# Altium schematic sheet Supply.SchDoc: Title (part 3 of 3)
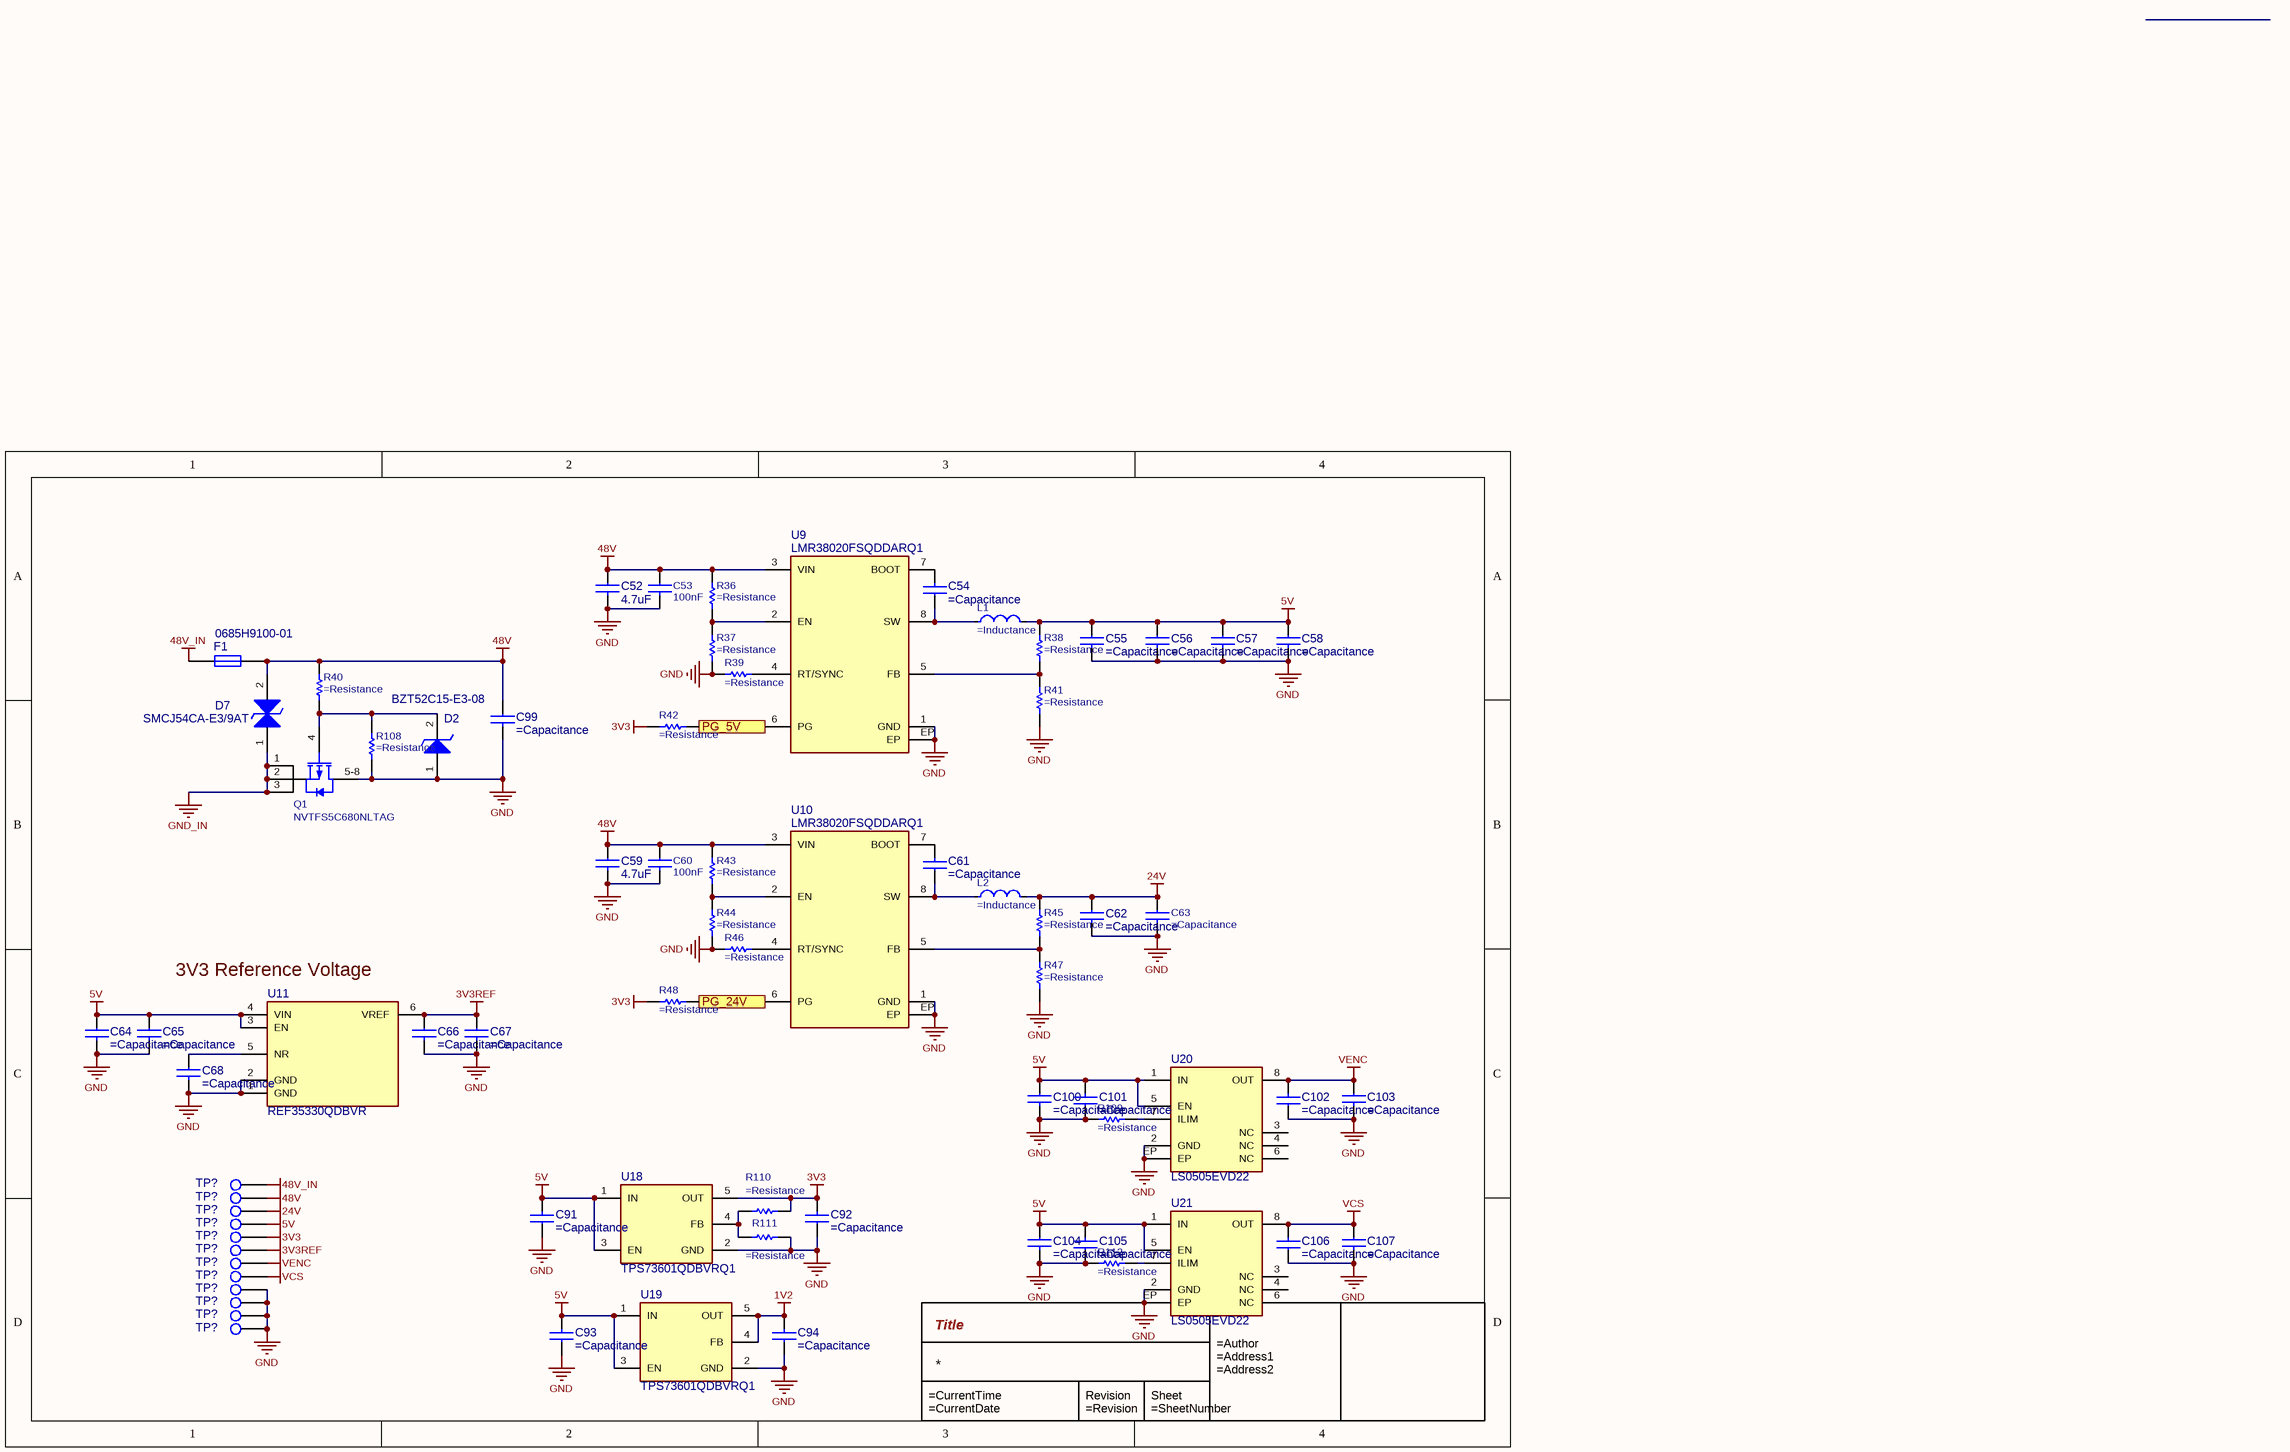
[diagram p2: Supply.SchDoc]

## Library data of the parts (continued)
R38 R45 = RES0402-100k-1%: Res Thick Film 0402 100K Ohm 1% 0.063W(1/16W) ±100ppm/C Molded SMD Automotive Paper T/R; Manufacturer: Vishay; Manufacturer Part Number: CRCW0402100KFKEE; Resistance: 100kΩ; Max Power Dissipation: 63mW; Value: 100kΩ; Temperature Coefficient: 100ppm/°C; Voltage Rating: 50V; Supplier 1: DigiKey; Supplier Part Number 1: 541-CRCW0402100KFKEECT-ND; Supplier: DigiKey; Supplier Part Number: 541-CRCW0402100KFKEECT-ND; RoHS: Compliant; Category: Chip SMD Resistors; Stock: 14497; Pricing: 1=0,1, 10=0,03, 25=0,0224, 50=0,018, 100=0,0148, 250=0,01156, 500=0,00974, 1000=0,00832, 5000=0,00606 (USD); Case/Package: 0402; China RoHS: Non-Compliant; Composition: Thick Film; Contact Plating: Tin; Depth: 500µm; Features: Automotive AEC-Q200; Height: 350µm; Lead Free: Lead Free; Length: 990.6µm; Lifecycle Status: Production; Max Operating Temperature: 155°C; Military Standard: Not; Min Operating Temperature: -55°C; Mounting Technology: Surface Mount; Number of Terminals: 2; Number of Terminations: 2; Packaging: Tape & Reel; Power Dissipation: 63mW; Power Rating: 63mW; Radiation Hardening: No; REACH SVHC: Yes; Schedule B: 8533210045, 8533210045|8533210045|8533210045|8533210045|8533210045|8533210045|8533210045|8533210045|8533210045|8533210045|8533210045|8533210045|8533210045|8533210045|8533210045|8533210045|8533210045|8533210045|8533210045|8533210045|8533210045|8533210045|8533210045|85; Tolerance: 1%; Voltage Rating (DC): 50V; Width: 500µm; Working Voltage: 50V; ComponentLink1URL: https://datasheet.octopart.com:443/CRCW0402100KFKEE-Vishay-datasheet-175423584.pdf?src-supplier=IHS; ComponentLink1Description: https://datasheet.octopart.com:443/CRCW0402100KFKEE-Vishay-datasheet-175423584.pdf?src-supplier=IHS; ComponentLink2URL: https://datasheet.octopart.com:443/CRCW0402100KFKEE-Vishay-datasheet-190005712.pdf?src-supplier=TME; ComponentLink2Description: https://datasheet.octopart.com:443/CRCW0402100KFKEE-Vishay-datasheet-190005712.pdf?src-supplier=TME; ComponentLink3URL: https://datasheet.octopart.com:443/CRCW0402100KFKEE-Vishay-datasheet-62316122.pdf?src-supplier=Future+Electronics; ComponentLink3Description: https://datasheet.octopart.com:443/CRCW0402100KFKEE-Vishay-datasheet-62316122.pdf?src-supplier=Future+Electronics; ComponentLink4URL: https://datasheet.octopart.com/D-CRCW-e3-Standard-Thick-Film-Chip-Resistors-Vishay-datasheet-family-64.pdf; ComponentLink4Description: https://datasheet.octopart.com/D-CRCW-e3-Standard-Thick-Film-Chip-Resistors-Vishay-datasheet-family-64.pdf; ComponentLink5URL: http://sigma.octopart.com:80/rohs_certificate/D-CRCW-e3-Standard-Thick-Film-Chip-Resistors-Vishay-family-102.pdf?src-supplier=Compliance+Statements; ComponentLink5Description: http://sigma.octopart.com:80/rohs_certificate/D-CRCW-e3-Standard-Thick-Film-Chip-Resistors-Vishay-family-102.pdf?src-supplier=Compliance+Statements
R39 = RES0402-64.9k-1%: Res Thick Film 0402 64.9K Ohm 1% 0.1W(1/10W) ±100ppm/C Pad SMD T/R Automotive AEC-Q200; Manufacturer: KOA Speer; Manufacturer Part Number: RK73H1ETTP6492F; Resistance: 64.9kΩ; Power Dissipation: 100mW; Power Rating: 63mW; Value: 64.9kΩ; Temperature Coefficient: 100ppm/°C; Voltage Rating: 50V; Working Voltage: 75V; Supplier 1: DigiKey; Supplier Part Number 1: 2019-RK73H1ETTP6492FCT-ND; Supplier: DigiKey; Supplier Part Number: 2019-RK73H1ETTP6492FCT-ND; RoHS: Compliant; Category: Chip SMD Resistors; Stock: 44078; Pricing: 1=0,1, 10=0,027, 25=0,0196, 50=0,0158, 100=0,0129, 250=0,01004, 500=0,0084, 1000=0,00713, 5000=0,00544 (USD); Case/Package: 0402; Case Code (Imperial): 0402; Case Code (Metric): 1005; China RoHS: Non-Compliant; Composition: Thick Film; Depth: 500µm; Height: 350µm; Lead Free: Lead Free; Length: 1mm; Lifecycle Status: Production; Max Operating Temperature: 155°C; Military Standard: Not; Min Operating Temperature: -55°C; Mounting Technology: Surface Mount; Number of Terminals: 2; REACH SVHC: Yes; Schedule B: 8533210045, 8533210045|8533210045|8533210045|8533210045|8533210045; Termination: SMD/SMT; Tolerance: 1%; Voltage Rating (DC): 50V; Width: 500µm; ComponentLink1URL: https://datasheet.octopart.com:443/RK73H1ETTP6492F-KOA-Speer-datasheet-181956035.pdf?src-supplier=IHS; ComponentLink1Description: https://datasheet.octopart.com:443/RK73H1ETTP6492F-KOA-Speer-datasheet-181956035.pdf?src-supplier=IHS; ComponentLink2URL: https://datasheet.octopart.com:443/RK73H1ETTP6492F-KOA-Speer-datasheet-11590619.pdf?src-supplier=Upverter; ComponentLink2Description: https://datasheet.octopart.com:443/RK73H1ETTP6492F-KOA-Speer-datasheet-11590619.pdf?src-supplier=Upverter; ComponentLink3URL: https://datasheet.octopart.com:443/RK73H1ETTP6492F-KOA-Speer-datasheet-149653815.pdf?src-supplier=element14+APAC; ComponentLink3Description: https://datasheet.octopart.com:443/RK73H1ETTP6492F-KOA-Speer-datasheet-149653815.pdf?src-supplier=element14+APAC; ComponentLink4URL: https://datasheet.octopart.com/RK73H-%7C-Flat-Chip-Resistors-%28Precision-Grade%29-KOA-Speer-datasheet-family-85.pdf; ComponentLink4Description: https://datasheet.octopart.com/RK73H-%7C-Flat-Chip-Resistors-%28Precision-Grade%29-KOA-Speer-datasheet-family-85.pdf; ComponentLink5URL: https://datasheet.octopart.com:443/RK73H1ETTP6492F-KOA-Speer-datasheet-5377299.pdf?src-supplier=Garrett; ComponentLink5Description: https://datasheet.octopart.com:443/RK73H1ETTP6492F-KOA-Speer-datasheet-5377299.pdf?src-supplier=Garrett; ComponentLink6URL: https://datasheet.octopart.com:443/RK73H1ETTP6492F-KOA-Speer-datasheet-148194.pdf?src-supplier=Garrett; ComponentLink6Description: https://datasheet.octopart.com:443/RK73H1ETTP6492F-KOA-Speer-datasheet-148194.pdf?src-supplier=Garrett; ComponentLink7URL: https://datasheet.octopart.com:443/RK73H1ETTP6492F-KOA-Speer-datasheet-109211.pdf?src-supplier=Garrett; ComponentLink7Description: https://datasheet.octopart.com:443/RK73H1ETTP6492F-KOA-Speer-datasheet-109211.pdf?src-supplier=Garrett; ComponentLink8URL: http://sigma.octopart.com:80/rohs_certificate/RK73H-%7C-Flat-Chip-Resistors-%28Precision-Grade%29-KOA-Speer-family-91.pdf?src-supplier=Compliance+Statements; ComponentLink8Description: http://sigma.octopart.com:80/rohs_certificate/RK73H-%7C-Flat-Chip-Resistors-%28Precision-Grade%29-KOA-Speer-family-91.pdf?src-supplier=Compliance+Statements
R41 = RES0402-24.9k-1%: Res Thick Film 0402 24.9K Ohm 1% 0.063W(1/16W) ±100ppm/C Pad SMD T/R; Manufacturer: Bourns; Manufacturer Part Number: CR0402-FX-2492GLF; Resistance: 24.9kΩ; Power Dissipation: 62.5mW; Value: 24.9kΩ; Temperature Coefficient: 100ppm/°C; Voltage Rating: 50V; Supplier 1: DigiKey; Supplier Part Number 1: CR0402-FX-2492GLFCT-ND; Supplier: DigiKey; Supplier Part Number: CR0402-FX-2492GLFCT-ND; RoHS: Compliant; Category: Chip SMD Resistors; Stock: 1453; Pricing: 1=0,1, 10=0,014, 25=0,010, 50=0,0058, 100=0,0041, 250=0,00272, 5000=0,00211 (USD); Case/Package: 0402; Case Code (Imperial): 0402; Case Code (Metric): 1005; China RoHS: Non-Compliant; Composition: Thick Film; Contact Plating: Tin; Depth: 500µm; Height: 320µm; Lifecycle Status: Production; Max Operating Temperature: 155°C; Military Standard: Not; Min Operating Temperature: -55°C; Mounting Technology: Surface Mount; Number of Terminals: 2; Power Rating: 62.5mW; Radiation Hardening: No; REACH SVHC: Yes; Schedule B: 8533210045, 8533210045|8533210045|8533210045|8533210045|8533210045; Termination: SMD/SMT; Tolerance: 1%; Width: 500µm; Working Voltage: 50V; ComponentLink1URL: https://datasheet.octopart.com:443/CR0402-FX-2492GLF-Bourns-datasheet-159578630.pdf?src-supplier=IHS; ComponentLink1Description: https://datasheet.octopart.com:443/CR0402-FX-2492GLF-Bourns-datasheet-159578630.pdf?src-supplier=IHS; ComponentLink2URL: https://datasheet.octopart.com:443/CR0402-FX-2492GLF-Bourns-datasheet-181955239.pdf?src-supplier=IHS; ComponentLink2Description: https://datasheet.octopart.com:443/CR0402-FX-2492GLF-Bourns-datasheet-181955239.pdf?src-supplier=IHS; ComponentLink3URL: https://datasheet.octopart.com:443/CR0402-FX-2492GLF-Bourns-datasheet-154729663.pdf?src-supplier=Electro+Sonic; ComponentLink3Description: https://datasheet.octopart.com:443/CR0402-FX-2492GLF-Bourns-datasheet-154729663.pdf?src-supplier=Electro+Sonic; ComponentLink4URL: https://datasheet.octopart.com/CR0402-FX-2492GLF-Bourns-datasheet-8723995.pdf; ComponentLink4Description: https://datasheet.octopart.com/CR0402-FX-2492GLF-Bourns-datasheet-8723995.pdf; ComponentLink5URL: https://datasheet.octopart.com:443/CR0402-FX-2492GLF-Bourns-datasheet-140567134.pdf?src-supplier=Arrow.cn; ComponentLink5Description: https://datasheet.octopart.com:443/CR0402-FX-2492GLF-Bourns-datasheet-140567134.pdf?src-supplier=Arrow.cn; ComponentLink6URL: http://sigma.octopart.com:80/conflict_mineral_statement/Bourns-company-36.pdf?src-supplier=Compliance+Statements; ComponentLink6Description: http://sigma.octopart.com:80/conflict_mineral_statement/Bourns-company-36.pdf?src-supplier=Compliance+Statements
R42 R48 = RES0402-10k-1%: Res Thick Film 0402 10K Ohm 1% 0.063W(1/16W) ±100ppm/C Pad SMD T/R Automotive AEC-Q200; Manufacturer: Vishay; Manufacturer Part Number: CRCW040210K0FKEE; Resistance: 10kΩ; Max Power Dissipation: 63mW; Value: 10kΩ; Temperature Coefficient: 100ppm/°C; Voltage Rating: 50V; Supplier 1: DigiKey; Supplier Part Number 1: 541-2954-1-ND; Supplier: DigiKey; Supplier Part Number: 541-2954-1-ND; RoHS: Compliant; Category: Chip SMD Resistors; Pricing: 1=0,1, 10=0,03, 25=0,0224, 50=0,018, 100=0,0148, 250=0,01156, 500=0,00974, 1000=0,00832, 5000=0,00637 (USD); Case/Package: 0402; Case Code (Imperial): 0402; Case Code (Metric): 1005; China RoHS: Non-Compliant; Composition: Thick Film; Contact Plating: Tin; Depth: 500µm; Features: Automotive AEC-Q200; Height: 350µm; Lead Free: Lead Free; Length: 990.6µm; Lifecycle Status: Production; Max Operating Temperature: 155°C; Military Standard: Not; Min Operating Temperature: -55°C; Mounting Technology: Surface Mount; Number of Terminals: 2; Number of Terminations: 2; Packaging: Tape & Reel; Power Dissipation: 63mW; Power Rating: 63mW; Radiation Hardening: No; REACH SVHC: Yes; Schedule B: 8533210045, 8533210045|8533210045|8533210045|8533210045|8533210045|8533210045|8533210045|8533210045|8533210045|8533210045|8533210045|8533210045|8533210045|8533210045|8533210045|8533210045|8533210045|8533210045|8533210045|8533210045|8533210045|8533210045|8533210045|85; Tolerance: 1%; Voltage Rating (DC): 50V; Width: 500µm; Working Voltage: 50V; ComponentLink1URL: https://datasheet.octopart.com:443/CRCW040210K0FKEE-Vishay-datasheet-175423584.pdf?src-supplier=IHS; ComponentLink1Description: https://datasheet.octopart.com:443/CRCW040210K0FKEE-Vishay-datasheet-175423584.pdf?src-supplier=IHS; ComponentLink2URL: https://datasheet.octopart.com:443/CRCW040210K0FKEE-Vishay-datasheet-62316122.pdf?src-supplier=Future+Electronics; ComponentLink2Description: https://datasheet.octopart.com:443/CRCW040210K0FKEE-Vishay-datasheet-62316122.pdf?src-supplier=Future+Electronics; ComponentLink3URL: http://sigma.octopart.com:80/rohs_statement/Vishay-company-15.pdf?src-supplier=Compliance+Statements; ComponentLink3Description: http://sigma.octopart.com:80/rohs_statement/Vishay-company-15.pdf?src-supplier=Compliance+Statements
R46 R110 = RES0402-52.3k-1%: Fixed Resistor, Metal Glaze/thick Film, 0.1W, 52300ohm, 75V, 0.5% +/-Tol, 100ppm/Cel, Surface Mount, 0402; Manufacturer: KOA Speer; Manufacturer Part Number: RK73H1ETTP5232D; Resistance: 52.3kΩ; Power Dissipation: 100mW; Value: 52.3kΩ; Temperature Coefficient: 100ppm/°C; Supplier 1: DigiKey; Supplier Part Number 1: 2019-RK73H1ETTP5232DTR-ND; Supplier: DigiKey; Supplier Part Number: 2019-RK73H1ETTP5232DTR-ND; RoHS: Compliant; Category: Chip SMD Resistors; Pricing: 10000=0,03493 (USD); Case/Package: 0402; China RoHS: Non-Compliant; Composition: Thick Film; Height: 350µm; Lead Free: Lead Free; Lifecycle Status: Production; Max Operating Temperature: 155°C; Min Operating Temperature: -55°C; Mounting Technology: Surface Mount; Number of Terminals: 2; Power Rating: 100mW; REACH SVHC: Yes; Tolerance: 0.5%; Voltage Rating: 75V; Width: 500µm; Working Voltage: 75V; ComponentLink1URL: https://datasheet.octopart.com:443/RK73H1ETTP5232D-KOA-Speer-datasheet-181956035.pdf?src-supplier=IHS; ComponentLink1Description: https://datasheet.octopart.com:443/RK73H1ETTP5232D-KOA-Speer-datasheet-181956035.pdf?src-supplier=IHS; ComponentLink2URL: https://sigma.octopart.com:443/138820520/technical_drawing/KOA-Speer-RK73H1ETTP5232D.pdf?src-supplier=Upverter; ComponentLink2Description: https://sigma.octopart.com:443/138820520/technical_drawing/KOA-Speer-RK73H1ETTP5232D.pdf?src-supplier=Upverter; ComponentLink3URL: https://datasheet.octopart.com:443/RK73H1ETTP5232D-KOA-Speer-datasheet-141253609.pdf?src-supplier=Upverter; ComponentLink3Description: https://datasheet.octopart.com:443/RK73H1ETTP5232D-KOA-Speer-datasheet-141253609.pdf?src-supplier=Upverter; ComponentLink4URL: https://datasheet.octopart.com/RK73H1ETTP5232D-KOA-Speer-datasheet-11590619.pdf; ComponentLink4Description: https://datasheet.octopart.com/RK73H1ETTP5232D-KOA-Speer-datasheet-11590619.pdf; ComponentLink5URL: http://sigma.octopart.com:80/rohs_statement/KOA-Speer-company-17.pdf?src-supplier=Compliance+Statements; ComponentLink5Description: http://sigma.octopart.com:80/rohs_statement/KOA-Speer-company-17.pdf?src-supplier=Compliance+Statements
R47 = RES0402-9.1k-1%: Res Thick Film 0402 9.1K Ohm 1% 0.063W(1/16W) ±100ppm/C Pad SMD T/R Automotive AEC-Q200; Manufacturer: Vishay; Manufacturer Part Number: CRCW04029K10FKED; Resistance: 9.1kΩ; Max Power Dissipation: 63mW; Value: 9.1kΩ; Temperature Coefficient: 100ppm/°C; Voltage Rating: 50V; Supplier 1: DigiKey; Supplier Part Number 1: 541-9.10KLCT-ND; Supplier: DigiKey; Supplier Part Number: 541-9.10KLCT-ND; RoHS: Compliant; Category: Chip SMD Resistors; Stock: 19718; Pricing: 1=0,1, 10=0,03, 25=0,0224, 50=0,018, 100=0,0148, 250=0,01156, 500=0,00974, 1000=0,00832, 5000=0,00637 (USD); Case/Package: 0402; Case Code (Imperial): 0402; China RoHS: Non-Compliant; Composition: Thick Film; Contact Plating: Tin; Depth: 500µm; Features: Automotive AEC-Q200; Height: 350µm; Lead Free: Lead Free; Length: 1mm; Lifecycle Status: Production; Max Operating Temperature: 155°C; Military Standard: Not; Min Operating Temperature: -55°C; Mounting Technology: Surface Mount; Pins: 2; Number of Terminals: 2; Number of Terminations: 2; Packaging: Cut Tape; Power Dissipation: 63mW; Power Rating: 63mW; Radiation Hardening: No; REACH SVHC: Yes; Schedule B: 8533210045; Termination: SMD/SMT; Tolerance: 1%; Voltage Rating (DC): 50V; Weight: 652.039032µg; Width: 500µm; Working Voltage: 50V; ComponentLink1URL: https://datasheet.octopart.com:443/CRCW04029K10FKED-Vishay-datasheet-175423584.pdf?src-supplier=IHS; ComponentLink1Description: https://datasheet.octopart.com:443/CRCW04029K10FKED-Vishay-datasheet-175423584.pdf?src-supplier=IHS; ComponentLink2URL: https://datasheet.octopart.com:443/CRCW04029K10FKED-Vishay-datasheet-83961561.pdf?src-supplier=Newark; ComponentLink2Description: https://datasheet.octopart.com:443/CRCW04029K10FKED-Vishay-datasheet-83961561.pdf?src-supplier=Newark; ComponentLink3URL: https://datasheet.octopart.com:443/CRCW04029K10FKED-Vishay-datasheet-66077789.pdf?src-supplier=Newark; ComponentLink3Description: https://datasheet.octopart.com:443/CRCW04029K10FKED-Vishay-datasheet-66077789.pdf?src-supplier=Newark; ComponentLink4URL: https://datasheet.octopart.com:443/CRCW04029K10FKED-Vishay-datasheet-11761042.pdf?src-supplier=Newark; ComponentLink4Description: https://datasheet.octopart.com:443/CRCW04029K10FKED-Vishay-datasheet-11761042.pdf?src-supplier=Newark; ComponentLink5URL: https://datasheet.octopart.com:443/CRCW04029K10FKED-Vishay-datasheet-11516975.pdf?src-supplier=Newark; ComponentLink5Description: https://datasheet.octopart.com:443/CRCW04029K10FKED-Vishay-datasheet-11516975.pdf?src-supplier=Newark; ComponentLink6URL: https://datasheet.octopart.com:443/CRCW04029K10FKED.-Vishay-datasheet-183883877.pdf?src-supplier=Newark; ComponentLink6Description: https://datasheet.octopart.com:443/CRCW04029K10FKED.-Vishay-datasheet-183883877.pdf?src-supplier=Newark; ComponentLink7URL: https://datasheet.octopart.com:443/CRCW04029K10FKED-Vishay-datasheet-159614168.pdf?src-supplier=Newark; ComponentLink7Description: https://datasheet.octopart.com:443/CRCW04029K10FKED-Vishay-datasheet-159614168.pdf?src-supplier=Newark; ComponentLink8URL: https://datasheet.octopart.com:443/CRCW04029K10FKED-Vishay-datasheet-41302739.pdf?src-supplier=Newark; ComponentLink8Description: https://datasheet.octopart.com:443/CRCW04029K10FKED-Vishay-datasheet-41302739.pdf?src-supplier=Newark; ComponentLink9URL: https://datasheet.octopart.com:443/CRCW04029K10FKED-Vishay-datasheet-21226360.pdf?src-supplier=Newark; ComponentLink9Description: https://datasheet.octopart.com:443/CRCW04029K10FKED-Vishay-datasheet-21226360.pdf?src-supplier=Newark; ComponentLink10URL: https://datasheet.octopart.com:443/CRCW04029K10FKED-Vishay-datasheet-62317933.pdf?src-supplier=element14+APAC; ComponentLink10Description: https://datasheet.octopart.com:443/CRCW04029K10FKED-Vishay-datasheet-62317933.pdf?src-supplier=element14+APAC; ComponentLink11URL: https://datasheet.octopart.com:443/CRCW04029K10FKED.-Vishay-datasheet-78776209.pdf?src-supplier=element14+APAC; ComponentLink11Description: https://datasheet.octopart.com:443/CRCW04029K10FKED.-Vishay-datasheet-78776209.pdf?src-supplier=element14+APAC; ComponentLink12URL: https://datasheet.octopart.com:443/CRCW04029K10FKED-Vishay-datasheet-14722531.pdf?src-supplier=element14+APAC; ComponentLink12Description: https://datasheet.octopart.com:443/CRCW04029K10FKED-Vishay-datasheet-14722531.pdf?src-supplier=element14+APAC; ComponentLink13URL: https://datasheet.octopart.com:443/CRCW04029K10FKED-Vishay-datasheet-31669108.pdf?src-supplier=element14+APAC; ComponentLink13Description: https://datasheet.octopart.com:443/CRCW04029K10FKED-Vishay-datasheet-31669108.pdf?src-supplier=element14+APAC; ComponentLink14URL: https://datasheet.octopart.com:443/CRCW04029K10FKED-Vishay-datasheet-41195454.pdf?src-supplier=Farnell; ComponentLink14Description: https://datasheet.octopart.com:443/CRCW04029K10FKED-Vishay-datasheet-41195454.pdf?src-supplier=Farnell; ComponentLink15URL: https://datasheet.octopart.com:443/CRCW04029K10FKED-Vishay-datasheet-62316122.pdf?src-supplier=Future+Electronics; ComponentLink15Description: https://datasheet.octopart.com:443/CRCW04029K10FKED-Vishay-datasheet-62316122.pdf?src-supplier=Future+Electronics; ComponentLink16URL: https://datasheet.octopart.com:443/CRCW04029K10FKED-Vishay-datasheet-12519820.pdf?src-supplier=Future+Electronics; ComponentLink16Description: https://datasheet.octopart.com:443/CRCW04029K10FKED-Vishay-datasheet-12519820.pdf?src-supplier=Future+Electronics; ComponentLink17URL: https://datasheet.octopart.com:443/CRCW04029K10FKED-Vishay-Dale-datasheet-47688880.pdf?src-supplier=RS+(Formerly+Allied+Electronics); ComponentLink17Description: https://datasheet.octopart.com:443/CRCW04029K10FKED-Vishay-Dale-datasheet-47688880.pdf?src-supplier=RS+(Formerly+Allied+Electronics); ComponentLink18URL: https://datasheet.octopart.com/D-CRCW-e3-Standard-Thick-Film-Chip-Resistors-Vishay-datasheet-family-64.pdf; ComponentLink18Description: https://datasheet.octopart.com/D-CRCW-e3-Standard-Thick-Film-Chip-Resistors-Vishay-datasheet-family-64.pdf; ComponentLink19URL: https://datasheet.octopart.com:443/CRCW04029K10FKED-Vishay-datasheet-11540273.pdf?src-supplier=Arrow+Electronics; ComponentLink19Description: https://datasheet.octopart.com:443/CRCW04029K10FKED-Vishay-datasheet-11540273.pdf?src-supplier=Arrow+Electronics; ComponentLink20URL: https://datasheet.octopart.com:443/CRCW04029K10FKED-Vishay-datasheet-8445837.pdf?src-supplier=element14; ComponentLink20Description: https://datasheet.octopart.com:443/CRCW04029K10FKED-Vishay-datasheet-8445837.pdf?src-supplier=element14; ComponentLink21URL: http://sigma.octopart.com:80/rohs_certificate/D-CRCW-e3-Standard-Thick-Film-Chip-Resistors-Vishay-family-102.pdf?src-supplier=Compliance+Statements; ComponentLink21Description: http://sigma.octopart.com:80/rohs_certificate/D-CRCW-e3-Standard-Thick-Film-Chip-Resistors-Vishay-family-102.pdf?src-supplier=Compliance+Statements
R109 R112 = RES0402-7.5k-1%: Res Thick Film 0402 7.5K Ohm 1% 1/16W ±100ppm/°C Molded SMD Paper T/R; Manufacturer: Vishay; Manufacturer Part Number: CRCW04027K50FKTD; Resistance: 7.5kΩ; Max Power Dissipation: 63mW; Value: 7.5kΩ; Voltage Rating: 50V; Supplier 1: DigiKey; Supplier Part Number 1: 541-CRCW04027K50FKTDCT-ND; Supplier: DigiKey; Supplier Part Number: 541-CRCW04027K50FKTDCT-ND; Category: Chip SMD Resistors; Stock: 13697; Pricing: 1=0,17, 10=0,082, 25=0,0648, 50=0,0546, 100=0,0451, 250=0,03808, 500=0,03412, 1000=0,0305, 5000=0,02473 (USD); Case/Package: 0402; Case Code (Imperial): 0402; Composition: Thick Film; Contact Plating: Lead, Tin; Depth: 500µm; Features: Automotive AEC-Q200; Height: 350µm; Lead Free: Contains Lead; Length: 1mm; Lifecycle Status: Production; Max Operating Temperature: 155°C; Military Standard: Not; Min Operating Temperature: -55°C; Mounting Technology: Surface Mount; Pins: 2; Number of Terminals: 2; Number of Terminations: 2; Power Dissipation: 63mW; Power Rating: 63mW; REACH SVHC: No; RoHS: Non-Compliant; Schedule B: 8533210045, 8533210045|8533210045|8533210045|8533210045|8533210045; Temperature Coefficient: 100ppm/°C; Tolerance: 1%; Voltage Rating (DC): 50V; Weight: 652.039032µg; Width: 500µm; Working Voltage: 50V; ComponentLink1URL: https://datasheet.octopart.com:443/CRCW04027K50FKTD-Vishay-datasheet-175863636.pdf?src-supplier=IHS; ComponentLink1Description: https://datasheet.octopart.com:443/CRCW04027K50FKTD-Vishay-datasheet-175863636.pdf?src-supplier=IHS; ComponentLink2URL: https://datasheet.octopart.com:443/CRCW04027K50FKTD-Vishay-datasheet-182027442.pdf?src-supplier=IHS; ComponentLink2Description: https://datasheet.octopart.com:443/CRCW04027K50FKTD-Vishay-datasheet-182027442.pdf?src-supplier=IHS; ComponentLink3URL: https://datasheet.octopart.com:443/CRCW04027K50FKTD-Vishay-datasheet-190005715.pdf?src-supplier=TME; ComponentLink3Description: https://datasheet.octopart.com:443/CRCW04027K50FKTD-Vishay-datasheet-190005715.pdf?src-supplier=TME; ComponentLink4URL: https://datasheet.octopart.com:443/CRCW04027K50FKTD-Vishay-datasheet-78776609.pdf?src-supplier=Newark; ComponentLink4Description: https://datasheet.octopart.com:443/CRCW04027K50FKTD-Vishay-datasheet-78776609.pdf?src-supplier=Newark; ComponentLink5URL: https://datasheet.octopart.com:443/CRCW04027K50FKTD-Vishay-datasheet-159614008.pdf?src-supplier=Newark; ComponentLink5Description: https://datasheet.octopart.com:443/CRCW04027K50FKTD-Vishay-datasheet-159614008.pdf?src-supplier=Newark; ComponentLink6URL: https://datasheet.octopart.com:443/CRCW04027K50FKTD-Vishay-datasheet-41302739.pdf?src-supplier=Newark; ComponentLink6Description: https://datasheet.octopart.com:443/CRCW04027K50FKTD-Vishay-datasheet-41302739.pdf?src-supplier=Newark; ComponentLink7URL: https://datasheet.octopart.com:443/CRCW04027K50FKTD-Vishay-datasheet-62316122.pdf?src-supplier=Future+Electronics; ComponentLink7Description: https://datasheet.octopart.com:443/CRCW04027K50FKTD-Vishay-datasheet-62316122.pdf?src-supplier=Future+Electronics; ComponentLink8URL: https://datasheet.octopart.com:443/CRCW04027K50FKTD-Vishay-datasheet-62316123.pdf?src-supplier=Future+Electronics; ComponentLink8Description: https://datasheet.octopart.com:443/CRCW04027K50FKTD-Vishay-datasheet-62316123.pdf?src-supplier=Future+Electronics; ComponentLink9URL: https://datasheet.octopart.com/D-CRCW-Lead-%28Pb%29-Bearing-Thick-Film%2C-Rectangular-Chip-Resistors-Vishay-datasheet-family-72.pdf; ComponentLink9Description: https://datasheet.octopart.com/D-CRCW-Lead-%28Pb%29-Bearing-Thick-Film%2C-Rectangular-Chip-Resistors-Vishay-datasheet-family-72.pdf; ComponentLink10URL: https://datasheet.octopart.com/CRCW04027K50FKTD-Vishay-datasheet-13242068.pdf; ComponentLink10Description: https://datasheet.octopart.com/CRCW04027K50FKTD-Vishay-datasheet-13242068.pdf; ComponentLink11URL: https://datasheet.octopart.com/CRCW04027K50FKTD-Vishay-datasheet-13195083.pdf; ComponentLink11Description: https://datasheet.octopart.com/CRCW04027K50FKTD-Vishay-datasheet-13195083.pdf; ComponentLink12URL: https://datasheet.octopart.com/CRCW04027K50FKTD-Vishay-datasheet-13034211.pdf; ComponentLink12Description: https://datasheet.octopart.com/CRCW04027K50FKTD-Vishay-datasheet-13034211.pdf; ComponentLink13URL: https://datasheet.octopart.com/CRCW04027K50FKTD-Vishay-datasheet-12600034.pdf; ComponentLink13Description: https://datasheet.octopart.com/CRCW04027K50FKTD-Vishay-datasheet-12600034.pdf; ComponentLink14URL: https://datasheet.octopart.com/CRCW04027K50FKTD-Vishay-datasheet-12532161.pdf; ComponentLink14Description: https://datasheet.octopart.com/CRCW04027K50FKTD-Vishay-datasheet-12532161.pdf; ComponentLink15URL: https://datasheet.octopart.com/CRCW04027K50FKTD-Vishay-datasheet-12517896.pdf; ComponentLink15Description: https://datasheet.octopart.com/CRCW04027K50FKTD-Vishay-datasheet-12517896.pdf; ComponentLink16URL: https://datasheet.octopart.com/CRCW04027K50FKTD-Vishay-datasheet-12509762.pdf; ComponentLink16Description: https://datasheet.octopart.com/CRCW04027K50FKTD-Vishay-datasheet-12509762.pdf; ComponentLink17URL: https://datasheet.octopart.com/CRCW04027K50FKTD-Vishay-datasheet-10322335.pdf; ComponentLink17Description: https://datasheet.octopart.com/CRCW04027K50FKTD-Vishay-datasheet-10322335.pdf; ComponentLink18URL: https://datasheet.octopart.com/CRCW04027K50FKTD-Vishay-datasheet-8788789.pdf; ComponentLink18Description: https://datasheet.octopart.com/CRCW04027K50FKTD-Vishay-datasheet-8788789.pdf; ComponentLink19URL: https://datasheet.octopart.com/CRCW04027K50FKTD-Vishay-datasheet-8361388.pdf; ComponentLink19Description: https://datasheet.octopart.com/CRCW04027K50FKTD-Vishay-datasheet-8361388.pdf; ComponentLink20URL: https://datasheet.octopart.com/CRCW04027K50FKTD-Vishay-datasheet-5306405.pdf; ComponentLink20Description: https://datasheet.octopart.com/CRCW04027K50FKTD-Vishay-datasheet-5306405.pdf; ComponentLink21URL: https://datasheet.octopart.com/CRCW04027K50FKTD-Vishay-datasheet-546287.pdf; ComponentLink21Description: https://datasheet.octopart.com/CRCW04027K50FKTD-Vishay-datasheet-546287.pdf; ComponentLink22URL: http://sigma.octopart.com:80/rohs_statement/Vishay-company-15.pdf?src-supplier=Compliance+Statements; ComponentLink22Description: http://sigma.octopart.com:80/rohs_statement/Vishay-company-15.pdf?src-supplier=Compliance+Statements
TP?#1-TP?#12 = TP: TEST POINT
U9 U10 = LMR38020FSQDDARQ1: IC REG BUCK ADJ 2A 8SOPWR "Buck Switching Regulator IC Positive Adjustable 1V 1 Output 2A 8-PowerSOIC (0.154"",...; Manufacturer: Texas Instruments; Manufacturer Lifecycle Status: ACTIVE; Supplier 1: DigiKey; Supplier Part Number 1: 296-LMR38020FSQDDARQ1CT-ND; Supplier: DigiKey; Supplier Part Number: 296-LMR38020FSQDDARQ1CT-ND; Manufacturer Part Number: LMR38020FSQDDARQ1; RoHS: Compliant; Category: Voltage Regulators - Switching; Stock: 1540; Pricing: 1=4,07, 10=3,075, 25=2,8276, 100=2,5554, 250=2,42556, 500=2,34734, 1000=2,28295 (USD); Height: 1.7mm; Length: 4.89mm; Lifecycle Status: Production; Pins: 8; Thickness: 1.48mm; Topology: Buck; Width: 3.9mm; ComponentLink1URL: https://octopart.com:443/opatz8j6/c1?t=RnKbBTbSmE3mjTD1dR24FxyAAtcUZqnsQtDsP4qaaRt0oyG7bshtEFBu6vLylXR4jlzlLxH3YmIwp75uhgYuaKa02Af3M3pSHYrF9pbP756NU9jKj6MH4kp6OAcZn4a9DC5xocQBQSlq5v0i5uUrz6awLaCEIzrqJ7aaisuqo65Tmwh3Bc2ynv2RGtflBgpihQofJD75ObVTodK6cEfO3189ygn4nEum5c9SOknZE1n8hxj51VceGFLxYMLlZFH9fKHDt994IbBDpdeFcmiK5QiXHxXg6LUBMib5BdLAinlGKrie-8d3XRVJszg1o4oV4UTj0HpNy-pOds8ffi4MwCw7MMBOt025wQ2CGDafjRTVZ1269USdfOZLbA8iskyM_VnTcjia_QULjA&src-supplier=Texas+Instruments; ComponentLink1Description: https://octopart.com:443/opatz8j6/c1?t=RnKbBTbSmE3mjTD1dR24FxyAAtcUZqnsQtDsP4qaaRt0oyG7bshtEFBu6vLylXR4jlzlLxH3YmIwp75uhgYuaKa02Af3M3pSHYrF9pbP756NU9jKj6MH4kp6OAcZn4a9DC5xocQBQSlq5v0i5uUrz6awLaCEIzrqJ7aaisuqo65Tmwh3Bc2ynv2RGtflBgpihQofJD75ObVTodK6cEfO3189ygn4nEum5c9SOknZE1n8hxj51VceGFLxYMLlZFH9fKHDt994IbBDpdeFcmiK5QiXHxXg6LUBMib5BdLAinlGKrie-8d3XRVJszg1o4oV4UTj0HpNy-pOds8ffi4MwCw7MMBOt025wQ2CGDafjRTVZ1269USdfOZLbA8iskyM_VnTcjia_QULjA&src-supplier=Texas+Instruments; ComponentLink2URL: https://datasheet.octopart.com:443/LMR38020FSQDDARQ1-Texas-Instruments-datasheet-184261082.pdf?src-supplier=LCSC; ComponentLink2Description: https://datasheet.octopart.com:443/LMR38020FSQDDARQ1-Texas-Instruments-datasheet-184261082.pdf?src-supplier=LCSC; ComponentLink3URL: http://sigma.octopart.com:80/conflict_mineral_statement/Texas-Instruments-company-63.pdf?src-supplier=Compliance+Statements; ComponentLink3Description: http://sigma.octopart.com:80/conflict_mineral_statement/Texas-Instruments-company-63.pdf?src-supplier=Compliance+Statements; ComponentLink4URL: http://sigma.octopart.com:80/reach_statement/Texas-Instruments-company-64.pdf?src-supplier=Compliance+Statements; ComponentLink4Description: http://sigma.octopart.com:80/reach_statement/Texas-Instruments-company-64.pdf?src-supplier=Compliance+Statements
U11 = REF35330QDBVR: IC VREF SERIES SOT23-6; Manufacturer: Texas Instruments; Max Supply Voltage: 6V; Min Supply Voltage: 3.55V; Nominal Supply Current: 650nA; Number of Outputs: 1NUMBER; Output Current: 10mA; Output Voltage: 3.3V; Supplier: Digikey; Supplier Part Number: 296-REF35330QDBVRCT-ND; Manufacturer Part Number: REF35330QDBVR; RoHS: No; Category: Voltage References; Stock: 5957; Pricing: 1=1,91, 10=1,407, 25=1,2812, 100=1,1426, 250=1,07652, 500=1,03672, 1000=1,00393 (USD); Case/Package: 926Case; Pins: 6NUMBER; Min Operating Temperature: -40°C; Max Operating Temperature: 125°C; Length: 2.9mm; Width: 1.6mm; Thickness: 1.2mm; Supplier 1: Digikey; Supplier Part Number 1: 296-REF35330QDBVRCT-ND
U18 U19 = TPS73601QDBVRQ1: LDO Regulator Pos 1.2V to 5.5V 0.4A Automotive 5-Pin SOT-23 T/R; Manufacturer: Texas Instruments; Manufacturer Lifecycle Status: ACTIVE; Accuracy: 1%; Dropout Voltage: 75mV; Max Output current: 400mA; Min Input Voltage: 1.7V; Number of Channels: 1; Output Type: Adjustable; Output Voltage Accuracy: 0.5%; Polarity: Positive; Quiescent Current: 300µA; Reference Voltage: 1.21V; Supplier 1: DigiKey; Supplier Part Number 1: 296-36845-1-ND; Supplier: DigiKey; Supplier Part Number: 296-36845-1-ND; Manufacturer Part Number: TPS73601QDBVRQ1; RoHS: Compliant; Category: LDO Voltage Regulators; Stock: 1826; Pricing: 1=2,89, 10=2,162, 25=1,9796, 100=1,7787, 250=1,68292, 500=1,62514, 1000=1,57759 (USD); Case/Package: SOT-23; Height: 1.45mm; Lead Free: Lead Free; Length: 2.9mm; Lifecycle Status: Production; Max Supply Voltage: 5.5V; Max Operating Temperature: 125°C; Max Output Voltage: 5.5V; Min Current Limit: 400mA; Min Operating Temperature: -40°C; Min Output Voltage: 1.2V; Number of Outputs: 1; Pins: 5; Number of Regulators: 1; Output Current: 400mA; Output Voltage: 5.5V; Packaging: Tape & Reel (TR); Radiation Hardening: No; Schedule B: 8542390000, 8542390000|8542390000|8542390000|8542390000|8542390000; Thickness: 1.2mm; Width: 1.6mm; ComponentLink1URL: https://sigma.octopart.com:443/177332311/technical_drawing/Texas-Instruments-TPS73601QDBVRQ1.pdf?src-supplier=Texas+Instruments; ComponentLink1Description: https://sigma.octopart.com:443/177332311/technical_drawing/Texas-Instruments-TPS73601QDBVRQ1.pdf?src-supplier=Texas+Instruments; ComponentLink2URL: https://octopart.com:443/opatz8j6/c1?t=IPrLS5GnXoEhlKIvtz8vMG7ybou4TW2YvgMpBNrA_XBAhXlKJ-zrlmMbTVttzpWN-kqJ0DoX4txIr-Aqzkx3XvKiTK9d7kplguMBUdBIgm-NC267quZrn1VNg12e0js8AT9Thc0GdTQDeFxHjO53u7kxM-RecPAvu05OmE9vMtDNG2p0jb4G6ceVO9_xYMpnSLp2EBQUC0MHOQO7NdqUr0_rllB7A0v-msh2wo99UWH-MCiJBTDrc9MeGvSxMuI3ivzzdCUtcAEoqCJ6K_E3PCyiy3lHf4XnvCOe_V8wTR0vzEiaJ2Yj43P2j64f32HLNWJ6_xf2cIxiYR0V7iX4t-HR5d5P2vTD5auGjySQBTSJVx_vKiry_PGPB71sg50onbc4Tboe&src-supplier=Texas+Instruments; ComponentLink2Description: https://octopart.com:443/opatz8j6/c1?t=IPrLS5GnXoEhlKIvtz8vMG7ybou4TW2YvgMpBNrA_XBAhXlKJ-zrlmMbTVttzpWN-kqJ0DoX4txIr-Aqzkx3XvKiTK9d7kplguMBUdBIgm-NC267quZrn1VNg12e0js8AT9Thc0GdTQDeFxHjO53u7kxM-RecPAvu05OmE9vMtDNG2p0jb4G6ceVO9_xYMpnSLp2EBQUC0MHOQO7NdqUr0_rllB7A0v-msh2wo99UWH-MCiJBTDrc9MeGvSxMuI3ivzzdCUtcAEoqCJ6K_E3PCyiy3lHf4XnvCOe_V8wTR0vzEiaJ2Yj43P2j64f32HLNWJ6_xf2cIxiYR0V7iX4t-HR5d5P2vTD5auGjySQBTSJVx_vKiry_PGPB71sg50onbc4Tboe&src-supplier=Texas+Instruments; ComponentLink3URL: https://sigma.octopart.com:443/175570406/technical_drawing/Texas-Instruments-TPS73601QDBVRQ1.pdf?src-supplier=Texas+Instruments; ComponentLink3Description: https://sigma.octopart.com:443/175570406/technical_drawing/Texas-Instruments-TPS73601QDBVRQ1.pdf?src-supplier=Texas+Instruments; ComponentLink4URL: https://sigma.octopart.com:443/169406034/technical_drawing/Texas-Instruments-TPS73601QDBVRQ1.pdf?src-supplier=Texas+Instruments; ComponentLink4Description: https://sigma.octopart.com:443/169406034/technical_drawing/Texas-Instruments-TPS73601QDBVRQ1.pdf?src-supplier=Texas+Instruments; ComponentLink5URL: https://sigma.octopart.com:443/155939316/technical_drawing/Texas-Instruments-TPS73601QDBVRQ1.pdf?src-supplier=Texas+Instruments; ComponentLink5Description: https://sigma.octopart.com:443/155939316/technical_drawing/Texas-Instruments-TPS73601QDBVRQ1.pdf?src-supplier=Texas+Instruments; ComponentLink6URL: https://sigma.octopart.com:443/102331370/technical_drawing/Texas-Instruments-TPS73601QDBVRQ1.pdf?src-supplier=Texas+Instruments; ComponentLink6Description: https://sigma.octopart.com:443/102331370/technical_drawing/Texas-Instruments-TPS73601QDBVRQ1.pdf?src-supplier=Texas+Instruments; ComponentLink7URL: https://datasheet.octopart.com:443/TPS73601QDBVRQ1-Texas-Instruments-datasheet-41218817.pdf?src-supplier=Texas+Instruments; ComponentLink7Description: https://datasheet.octopart.com:443/TPS73601QDBVRQ1-Texas-Instruments-datasheet-41218817.pdf?src-supplier=Texas+Instruments; ComponentLink8URL: https://sigma.octopart.com:443/49249325/technical_drawing/Texas-Instruments-TPS73601QDBVRQ1.pdf?src-supplier=Texas+Instruments; ComponentLink8Description: https://sigma.octopart.com:443/49249325/technical_drawing/Texas-Instruments-TPS73601QDBVRQ1.pdf?src-supplier=Texas+Instruments; ComponentLink9URL: https://datasheet.octopart.com:443/TPS73601QDBVRQ1-Texas-Instruments-datasheet-163782275.pdf?src-supplier=Augswan; ComponentLink9Description: https://datasheet.octopart.com:443/TPS73601QDBVRQ1-Texas-Instruments-datasheet-163782275.pdf?src-supplier=Augswan; ComponentLink10URL: http://sigma.octopart.com:80/reach_statement/Texas-Instruments-company-64.pdf?src-supplier=Compliance+Statements; ComponentLink10Description: http://sigma.octopart.com:80/reach_statement/Texas-Instruments-company-64.pdf?src-supplier=Compliance+Statements; ComponentLink11URL: http://sigma.octopart.com:80/conflict_mineral_statement/Texas-Instruments-company-63.pdf?src-supplier=Compliance+Statements; ComponentLink11Description: http://sigma.octopart.com:80/conflict_mineral_statement/Texas-Instruments-company-63.pdf?src-supplier=Compliance+Statements
U20 U21 = LS0505EVD22: Hot Swap Controller 1-CH 6V N-Channel Electronic Fuse/Hot Swap Controller 8-Pin DFN EP T/R; Manufacturer: Littelfuse; Max Supply Voltage: 28V; Min Supply Voltage: 2.7V; Number of Channels: 1; Operating Supply Voltage: 5V; Supplier 1: DigiKey; Supplier Part Number 1: 18-LS0505EVD22CT-ND; Supplier: DigiKey; Supplier Part Number: 18-LS0505EVD22CT-ND; Manufacturer Part Number: LS0505EVD22; RoHS: Compliant; Category: Integrated Circuits (ICs); Stock: 16008; Pricing: 1=0,75, 10=0,643, 100=0,5, 500=0,439, 1000=0,4131 (USD); Height - Seated (Max): 800µm; Length: 2mm; Lifecycle Status: Production; Max Operating Temperature: 125°C; Min Operating Temperature: -40°C; Number of Circuits: 1; Number of Terminals: 8; REACH SVHC: Yes; Terminal Pitch: 500µm; Width: 2mm; ComponentLink1URL: https://datasheet.octopart.com:443/LS0505EVD22-Littelfuse-datasheet-166056112.pdf?src-supplier=IHS; ComponentLink1Description: https://datasheet.octopart.com:443/LS0505EVD22-Littelfuse-datasheet-166056112.pdf?src-supplier=IHS